# EAGLE design MF_NG (EAGLE 7.1.0)

## Sheet 1 of 2
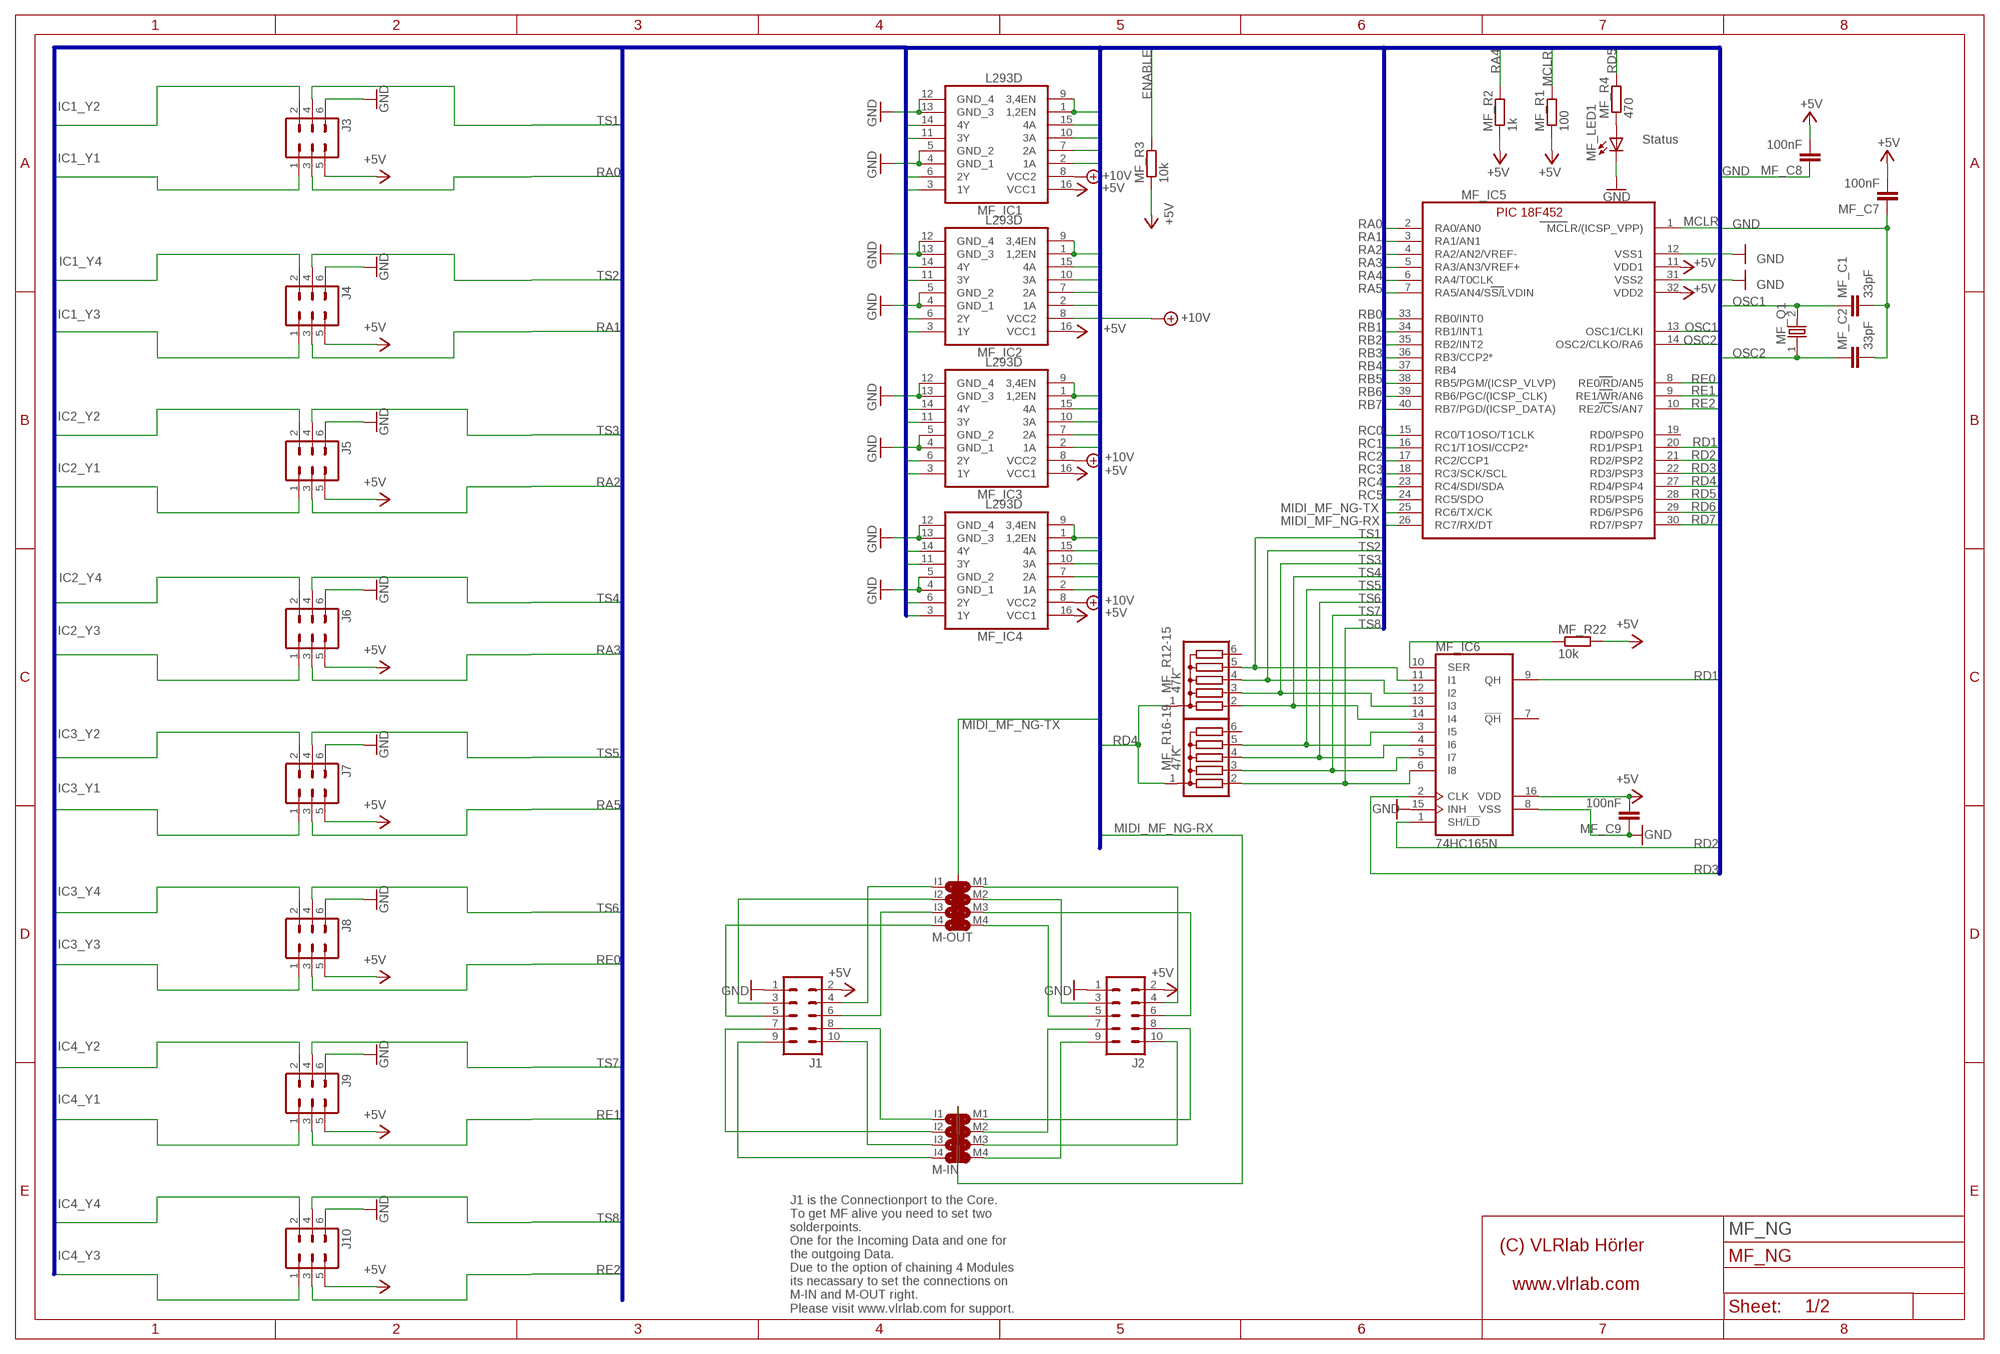
[diagram p0: schematic, sheet 1]

### Parts
J1  ML10ML10_TEXTFRONT  [ML10_TEXTFRONT]
J2  ML10ML10_TEXTFRONT  [ML10_TEXTFRONT]
J3  ML6  [ML6]
J4  ML6  [ML6]
J5  ML6  [ML6]
J6  ML6  [ML6]
J7  ML6  [ML6]
J8  ML6  [ML6]
J9  ML6  [ML6]
J10  ML6  [ML6]
M-IN  SJ2X4MIDI  [SJ_2X4MIDI]
M-OUT  SJ2X4MIDI  [SJ_2X4MIDI]
MF_C1  33pF  C-EU025-030X050  [C025-030X050]
MF_C2  33pF  C-EU025-030X050  [C025-030X050]
MF_C7  100nF  C-EU025-025X050  [C025-025X050]
MF_C8  100nF  C-EU025-025X050  [C025-025X050]
MF_C9  100nF  C-EU025-025X050  [C025-025X050]
MF_IC1  L293D  [DIL16]
MF_IC2  L293D  [DIL16]
MF_IC3  L293D  [DIL16]
MF_IC4  L293D  [DIL16]
MF_IC5  PIC18F452  PIC18F4X2DIL40  [DIL40]
MF_IC6  74HC165N  [DIL16]
MF_LED1  Status  LED3MM  [LED3MM]
MF_Q1  ECS-100-20-4X-DU  [HC-49/USX]
MF_R1  100  R-EU_0204/7  [0204/7]
MF_R2  1k  R-EU_0204/7  [0204/7]
MF_R3  10k  R-EU_0204/7  [0204/7]
MF_R4  470  R-EU_0204/7  [0204/7]
MF_R12-15  47k  4306R  [SIL6]
MF_R16-19  47K  4306R  [SIL6]
MF_R22  10k  R-EU_0204/7  [0204/7]

### Nets
+5V [VDD]: J1.2 J2.2 J3.5 J4.5 J5.5 J6.5 J7.5 J8.5 J9.5 J10.5 MF_C7.2 MF_C8.2 MF_C9.2 MF_IC1.16(VCC1) MF_IC2.16(VCC1) MF_IC3.16(VCC1) MF_IC4.16(VCC1) MF_IC5.11(VDD1) MF_IC5.32(VDD2) MF_IC6.16(VDD) MF_R1.1 MF_R2.1 MF_R3.1 MF_R22.2 ; also sheet 2
+10V [10V]: MF_IC1.8(VCC2) MF_IC2.8(VCC2) MF_IC3.8(VCC2) MF_IC4.8(VCC2) ; also sheet 2
ENABLE: MF_IC1.1(1,2EN) MF_IC1.9(3,4EN) MF_IC2.1(1,2EN) MF_IC2.9(3,4EN) MF_IC3.1(1,2EN) MF_IC3.9(3,4EN) MF_IC4.1(1,2EN) MF_IC4.9(3,4EN) MF_R3.2
GND: J1.1 J2.1 J3.6 J4.6 J5.6 J6.6 J7.6 J8.6 J9.6 J10.6 MF_C1.2 MF_C2.2 MF_C7.1 MF_C8.1 MF_C9.1 MF_IC1.4(GND_1) MF_IC1.5(GND_2) MF_IC1.12(GND_4) MF_IC1.13(GND_3) MF_IC2.4(GND_1) MF_IC2.5(GND_2) MF_IC2.12(GND_4) MF_IC2.13(GND_3) MF_IC3.4(GND_1) MF_IC3.5(GND_2) MF_IC3.12(GND_4) MF_IC3.13(GND_3) MF_IC4.4(GND_1) MF_IC4.5(GND_2) MF_IC4.12(GND_4) MF_IC4.13(GND_3) MF_IC5.12(VSS1) MF_IC5.31(VSS2) MF_IC6.8(VSS) MF_IC6.15(INH) MF_LED1.K(C) ; also sheet 2
IC1_Y1 [10V]: J3.1 MF_IC1.3(1Y)
IC1_Y2 [10V]: J3.2 MF_IC1.6(2Y)
IC1_Y3 [10V]: J4.1 MF_IC1.11(3Y)
IC1_Y4 [10V]: J4.2 MF_IC1.14(4Y)
IC2_Y1 [10V]: J5.1 MF_IC2.3(1Y)
IC2_Y2 [10V]: J5.2 MF_IC2.6(2Y)
IC2_Y3 [10V]: J6.1 MF_IC2.11(3Y)
IC2_Y4 [10V]: J6.2 MF_IC2.14(4Y)
IC3_Y1 [10V]: J7.1 MF_IC3.3(1Y)
IC3_Y2 [10V]: J7.2 MF_IC3.6(2Y)
IC3_Y3 [10V]: J8.1 MF_IC3.11(3Y)
IC3_Y4 [10V]: J8.2 MF_IC3.14(4Y)
IC4_Y1 [10V]: J9.1 MF_IC4.3(1Y)
IC4_Y2 [10V]: J9.2 MF_IC4.6(2Y)
IC4_Y3 [10V]: J10.1 MF_IC4.11(3Y)
IC4_Y4 [10V]: J10.2 MF_IC4.14(4Y)
MCLR: MF_IC5.1(MCLR/(ICSP_VPP)) MF_R1.2
MIDI_MF_NG-RX: M-IN.0 MF_IC5.26(RC7/RX/DT)
MIDI_MF_NG-TX: M-OUT.0 MF_IC5.25(RC6/TX/CK)
N$1: MF_IC6.10(SER) MF_R22.1
N$2: MF_LED1.A MF_R4.1
N$3: J1.4 M-OUT.I1
N$4: J1.3 M-OUT.I2
N$5: J1.6 M-OUT.I3
N$6: J1.5 M-OUT.I4
N$7: J2.4 M-OUT.M1
N$8: J2.3 M-OUT.M2
N$9: J2.6 M-OUT.M3
N$10: J2.5 M-OUT.M4
N$11: J1.8 M-IN.I1
N$12: J1.7 M-IN.I2
N$13: J1.10 M-IN.I3
N$14: J1.9 M-IN.I4
N$15: J2.8 M-IN.M1
N$16: J2.7 M-IN.M2
N$17: J2.10 M-IN.M3
N$18: J2.9 M-IN.M4
OSC1: MF_C1.1 MF_IC5.13(OSC1/CLKI) MF_Q1.2
OSC2: MF_C2.1 MF_IC5.14(OSC2/CLKO/RA6) MF_Q1.1
RA0: J3.3 MF_IC5.2(RA0/AN0)
RA1: J4.3 MF_IC5.3(RA1/AN1)
RA2: J5.3 MF_IC5.4(RA2/AN2/VREF-)
RA3: J6.3 MF_IC5.5(RA3/AN3/VREF+)
RA4: MF_IC5.6(RA4/T0CLK) MF_R2.2
RA5: J7.3 MF_IC5.7(RA5/AN4/SS/LVDIN)
RB0: MF_IC2.15(4A) MF_IC5.33(RB0/INT0)
RB1: MF_IC2.10(3A) MF_IC5.34(RB1/INT1)
RB2: MF_IC2.7(2A) MF_IC5.35(RB2/INT2)
RB3: MF_IC2.2(1A) MF_IC5.36(RB3/CCP2*)
RB4: MF_IC1.15(4A) MF_IC5.37(RB4)
RB5: MF_IC1.10(3A) MF_IC5.38(RB5/PGM/(ICSP_VLVP))
RB6: MF_IC1.7(2A) MF_IC5.39(RB6/PGC/(ICSP_CLK))
RB7: MF_IC1.2(1A) MF_IC5.40(RB7/PGD/(ICSP_DATA))
RC0: MF_IC4.15(4A) MF_IC5.15(RC0/T1OSO/T1CLK)
RC1: MF_IC4.10(3A) MF_IC5.16(RC1/T1OSI/CCP2*)
RC2: MF_IC4.7(2A) MF_IC5.17(RC2/CCP1)
RC3: MF_IC4.2(1A) MF_IC5.18(RC3/SCK/SCL)
RC4: MF_IC3.15(4A) MF_IC5.23(RC4/SDI/SDA)
RC5: MF_IC3.10(3A) MF_IC5.24(RC5/SDO)
RD1: MF_IC5.20(RD1/PSP1) MF_IC6.9(QH)
RD2: MF_IC5.21(RD2/PSP2) MF_IC6.1(SH/!LD)
RD3: MF_IC5.22(RD3/PSP3) MF_IC6.2(CLK)
RD4: MF_IC5.27(RD4/PSP4) MF_R12-15.1 MF_R16-19.1
RD5: MF_IC5.28(RD5/PSP5) MF_R4.2
RD6: MF_IC3.7(2A) MF_IC5.29(RD6/PSP6)
RD7: MF_IC3.2(1A) MF_IC5.30(RD7/PSP7)
RE0: J8.3 MF_IC5.8(RE0/RD/AN5)
RE1: J9.3 MF_IC5.9(RE1/WR/AN6)
RE2: J10.3 MF_IC5.10(RE2/CS/AN7)
TS1: J3.4 MF_IC6.11(I1) MF_R12-15.5
TS2: J4.4 MF_IC6.12(I2) MF_R12-15.4
TS3: J5.4 MF_IC6.13(I3) MF_R12-15.3
TS4: J6.4 MF_IC6.14(I4) MF_R12-15.2
TS5: J7.4 MF_IC6.3(I5) MF_R16-19.5
TS6: J8.4 MF_IC6.4(I6) MF_R16-19.4
TS7: J9.4 MF_IC6.5(I7) MF_R16-19.3
TS8: J10.4 MF_IC6.6(I8) MF_R16-19.2
Unconnected: MF_IC5.19(RD0/PSP0) MF_IC6.7(!QH) MF_R12-15.6 MF_R16-19.6

### Buses
ENABLE,IC1_Y[1..4],IC2_Y[1..4],IC3_Y[1..4],IC4_Y[1..4],MCLR,RA0,RA1,RA2,RA3,RA4,RA5,RE0,RE1,RE2,VDD_5V,VDD_M,GND,OSC1,OSC2,RC0,RC1,RC2,RC3,RD0,RD1,RD2,RD3,RC4,RC5,TX,RX,RD4,RD5,RD6,RD7,RB0,RB1,RB2,RB3,RB4,RB5,RB6,RB7,TS1,TS2,TS3,TS4,TS5,TS6,TS7,TS8,MIDI_MF_NG-TX,MIDI_MF_NG-RX

### Notes on the sheet
- MF_NG
- J1 is the Connectionport to the Core.
  To get MF alive you need to set two
  solderpoints.
  One for the Incoming Data and one for 
  the outgoing Data.
  Due to the option of chaining 4 Modules 
  its necassary to set the connections on 
  M-IN and M-OUT right.
  Please visit www.vlrlab.com for support.

## Sheet 2 of 2
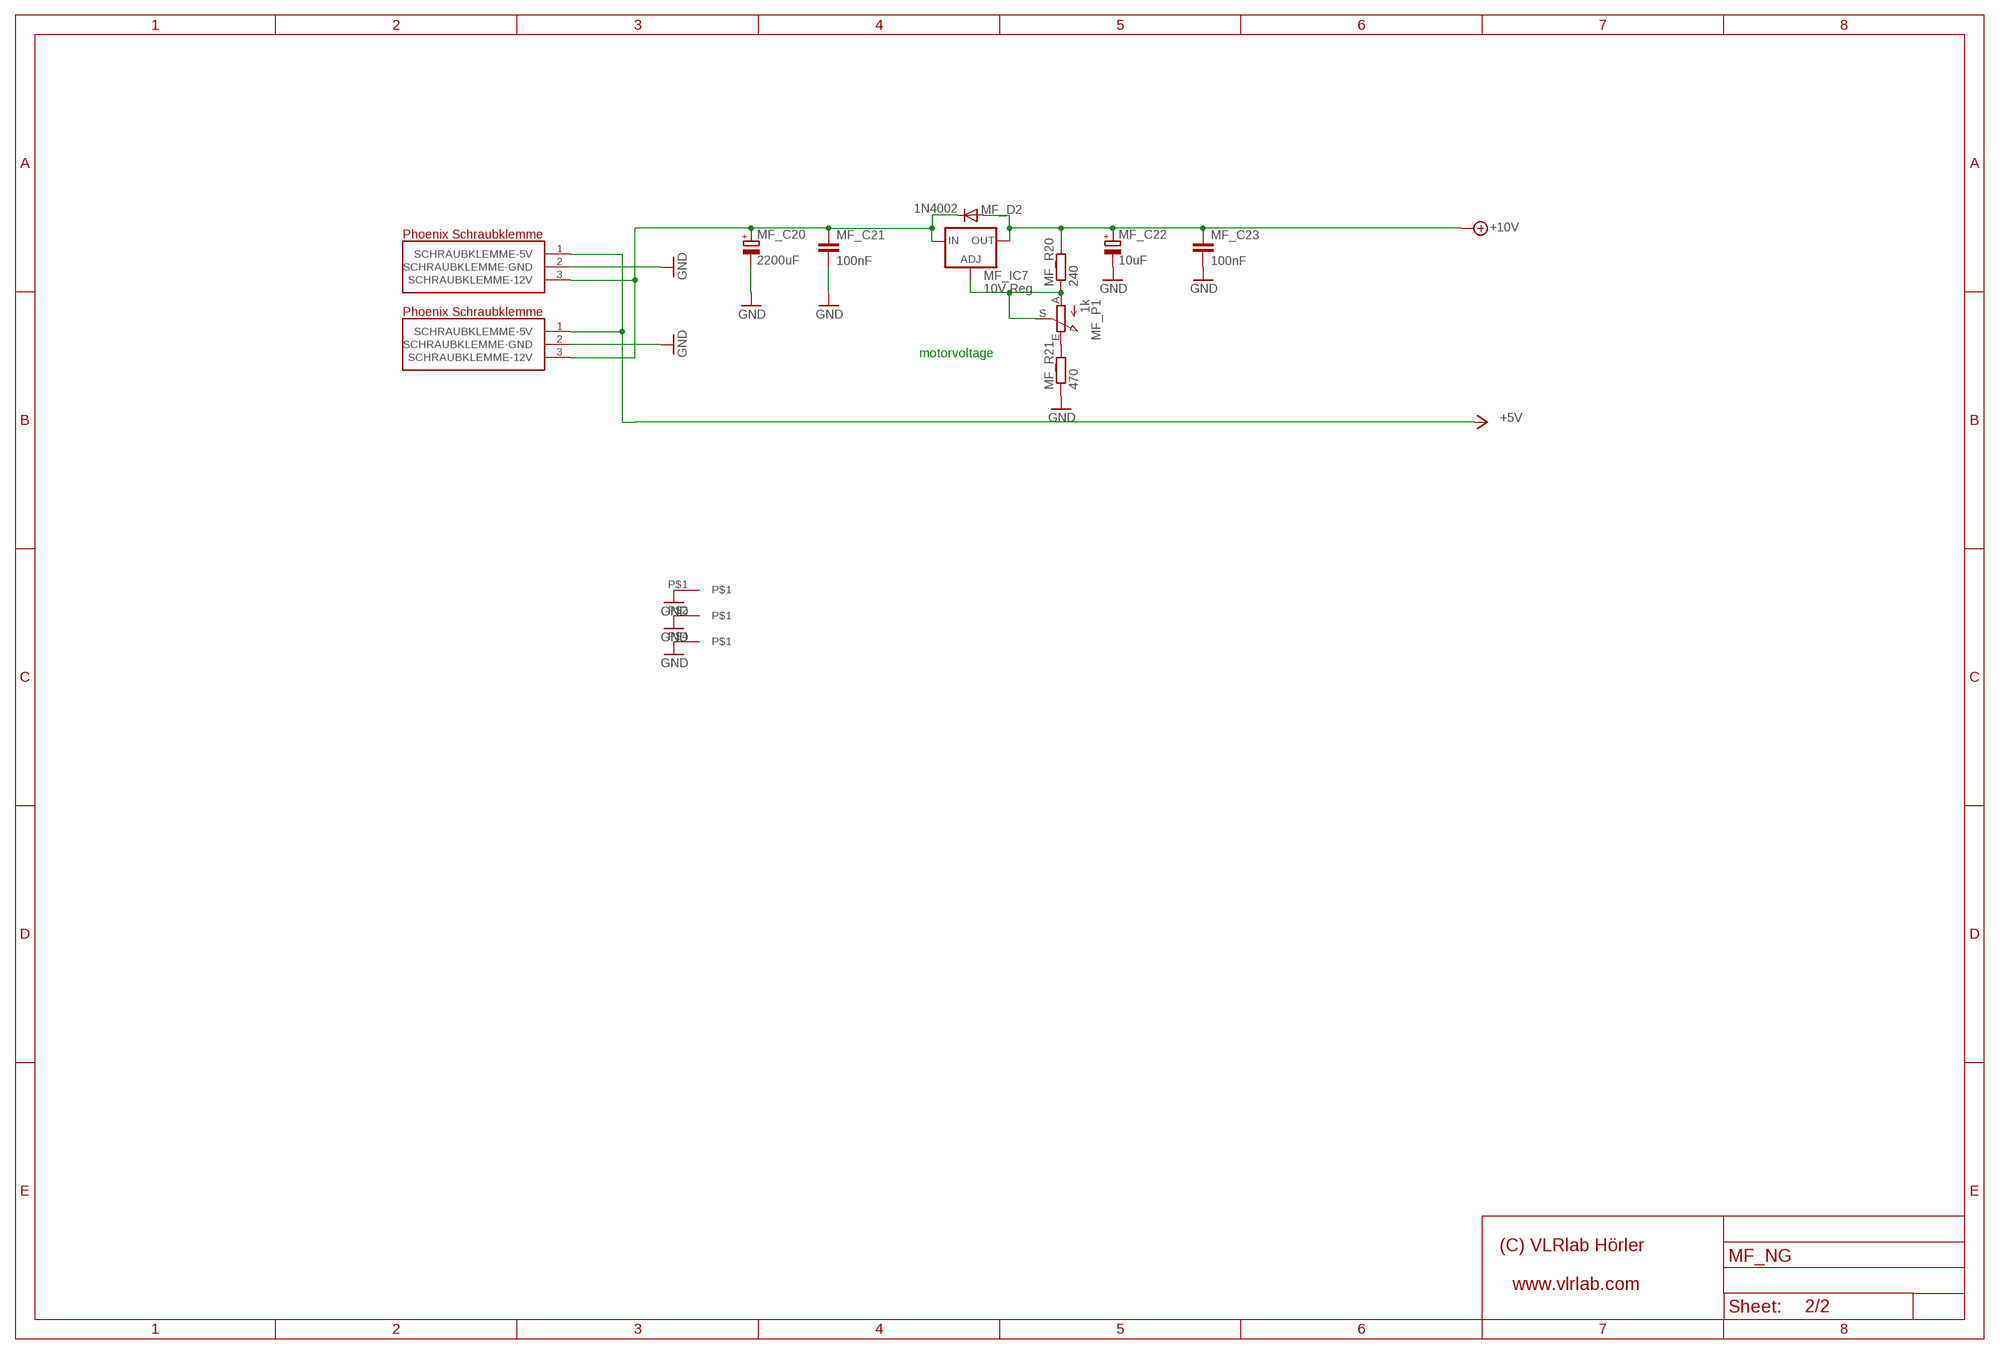
[diagram p1: schematic, sheet 2]

### Parts
KLEMME1  PT-1.5/3  [PT-1.5/3-5.0]
KLEMME2  PT-1.5/3  [PT-1.5/3-5.0]
MF_C20  2200uF  CPOL-EUE5-13  [E5-13]
MF_C21  100nF  C-EU025-025X050  [C025-025X050]
MF_C22  10uF  CPOL-EUE2,5-6E  [E2,5-6E]
MF_C23  100nF  C-EU025-025X050  [C025-025X050]
MF_D2  1N4002  [D040-10]
MF_IC7  10V Reg  LM317TS  [317TS]
MF_P1  1k  PHIER_6MM  [6MM_V]
MF_R20  240  R-EU_0204/7  [0204/7]
MF_R21  470  R-EU_0204/7  [0204/7]
U$3  MIDIBOX_HALF  [MIDIBOX14X6]

### Nets
+5V [VDD]: KLEMME1.1(SCHRAUBKLEMME-5V) KLEMME2.1(SCHRAUBKLEMME-5V) ; also sheet 1
+10V [10V]: MF_C22.+ MF_C23.1 MF_D2.A MF_IC7.2(OUT) MF_R20.2 ; also sheet 1
+12V [10V]: KLEMME1.3(SCHRAUBKLEMME-12V) KLEMME2.3(SCHRAUBKLEMME-12V) MF_C20.+ MF_C21.1 MF_D2.C MF_IC7.3(IN)
GND: KLEMME1.2(SCHRAUBKLEMME-GND) KLEMME2.2(SCHRAUBKLEMME-GND) MF_C20.- MF_C21.2 MF_C22.- MF_C23.2 MF_R21.1 U$3.P$1 U$3.P$2 U$3.P$4 ; also sheet 1
N$98: MF_IC7.1(ADJ) MF_P1.A MF_P1.S MF_R20.1
N$105: MF_P1.E MF_R21.2

### Notes on the sheet
- motorvoltage

## Library data of the parts
J1 J2 = con-ml_Ivan:ML10: HARTING
J3-J10 = con-ml:ML6: HARTING; OC_FARNELL: unknown; OC_NEWARK: unknown
KLEMME1 KLEMME2 = Phonenix Contacts:PT-1.5/3
M-IN M-OUT = Jumper:SJ2X4MIDI
MF_C1 MF_C2 MF_C7-MF_C9 MF_C21 MF_C23 = rcl:C-EU: CAPACITOR, European symbol
MF_C20 = resistor:CPOL-EU: POLARIZED CAPACITOR, European symbol
MF_C22 = rcl:CPOL-EU: POLARIZED CAPACITOR, European symbol
MF_D2 = Diode 1N4002:1N4002
MF_IC1-MF_IC4 = L293:L293D
MF_IC5 = pic18f452:PIC18F4X2: Pic Microcontroller
MF_IC6 = 74-595:74HC165N
MF_IC7 = v-reg:LM317TS: VOLTAGE REGULATOR
MF_LED1 = led:LED: LED OSRAM: - CHIPLED LG R971, LG N971, LY N971, LG Q971, LY Q971, LO R971, LY R971 LH N974, LH R974 LS Q976, LO Q976, LY Q976 LO Q996 - Hyper CHIPLED LW Q18S LB Q993, LB Q99A, LB R99A - SideLED LS A670, LO A670, LY A670, LG A670, LP A670 LB A673, LV A673, LT A673, LW A673 LH A674 LY A675 LS A676, LA A676, LO A676, LY A676, LW A676 LS A679, LY A679, LG A679 - Hyper Micro SIDELED® LS Y876, LA Y876, LO Y876, LY Y876 LT Y87S - SmartLED LW L88C, LW L88S LB L89C, LB L89S, LG L890 LS L89K, LO L89K, LY L89K LS L896, LA L896, LO L896, LY L896 - TOPLED LS T670, LO T670, LY T670, LG T670, LP T670 LSG T670, LSP T670, LSY T670, LOP T670, LYG T670 LG T671, LOG T671, LSG T671 LB T673, LV T673, LT T673, LW T673 LH T674 LS T676, LA T676, LO T676, LY T676, LB T676, LH T676, LSB T676, LW T676 LB T67C, LV T67C, LT T67C, LS T67K, LO T67K, LY T67K, LW E67C LS E67B, LA E67B, LO E67B, LY E67B, LB E67C, LV E67C, LT E67C LW T67C LS T679, LY T679, LG T679 LS T770, LO T770, LY T770, LG T770, LP T770 LB T773, LV T773, LT T773, LW T773 LH T774 LS E675, LA E675, LY E675, LS T675 LS T776, LA T776, LO T776, LY T776, LB T776 LHGB T686 LT T68C, LB T68C - Hyper Mini TOPLED® LB M676 - Mini TOPLED Santana® LG M470 LS M47K, LO M47K, LY M47K Source: http://www.osram.convergy.de LUXEON: - LUMILED® LXK2-PW12-R00, LXK2-PW12-S00, LXK2-PW14-U00, LXK2-PW14-V00 LXK2-PM12-R00, LXK2-PM12-S00, LXK2-PM14-U00 LXK2-PE12-Q00, LXK2-PE12-R00, LXK2-PE12-S00, LXK2-PE14-T00, LXK2-PE14-U00 LXK2-PB12-K00, LXK2-PB12-L00, LXK2-PB12-M00, LXK2-PB14-N00, LXK2-PB14-P00, LXK2-PB14-Q00 LXK2-PR12-L00, LXK2-PR12-M00, LXK2-PR14-Q00, LXK2-PR14-R00 LXK2-PD12-Q00, LXK2-PD12-R00, LXK2-PD12-S00 LXK2-PH12-R00, LXK2-PH12-S00 LXK2-PL12-P00, LXK2-PL12-Q00, LXK2-PL12-R00 Source: www.luxeon.com KINGBRIGHT: KA-3528ASYC Source: www.kingbright.com
MF_P1 = Potentiometer 6mm:PHIER_6MM
MF_Q1 = Cristal_10MHz:ECS-100-20-4X-DU
MF_R1-MF_R4 MF_R22 = resistor:R-EU_: RESISTOR, European symbol
MF_R12-15 MF_R16-19 = Bourns Resistor Array:4306R
MF_R20 MF_R21 = rcl:R-EU_: RESISTOR, European symbol
U$3 = Frames_VLR:MIDIBOX_HALF

## Net classes
0 default: width 0.254 mm, drill 0.33 mm, clearance 0.203 mm
1 VDD: width 0.813 mm, drill 0.33 mm, clearance 0.203 mm to class 0, clearance 0.203 mm
2 10V: width 1.016 mm, drill 0.33 mm, clearance 0.254 mm to class 0, clearance 0.203 mm to class 1, clearance 0.203 mm

## Board
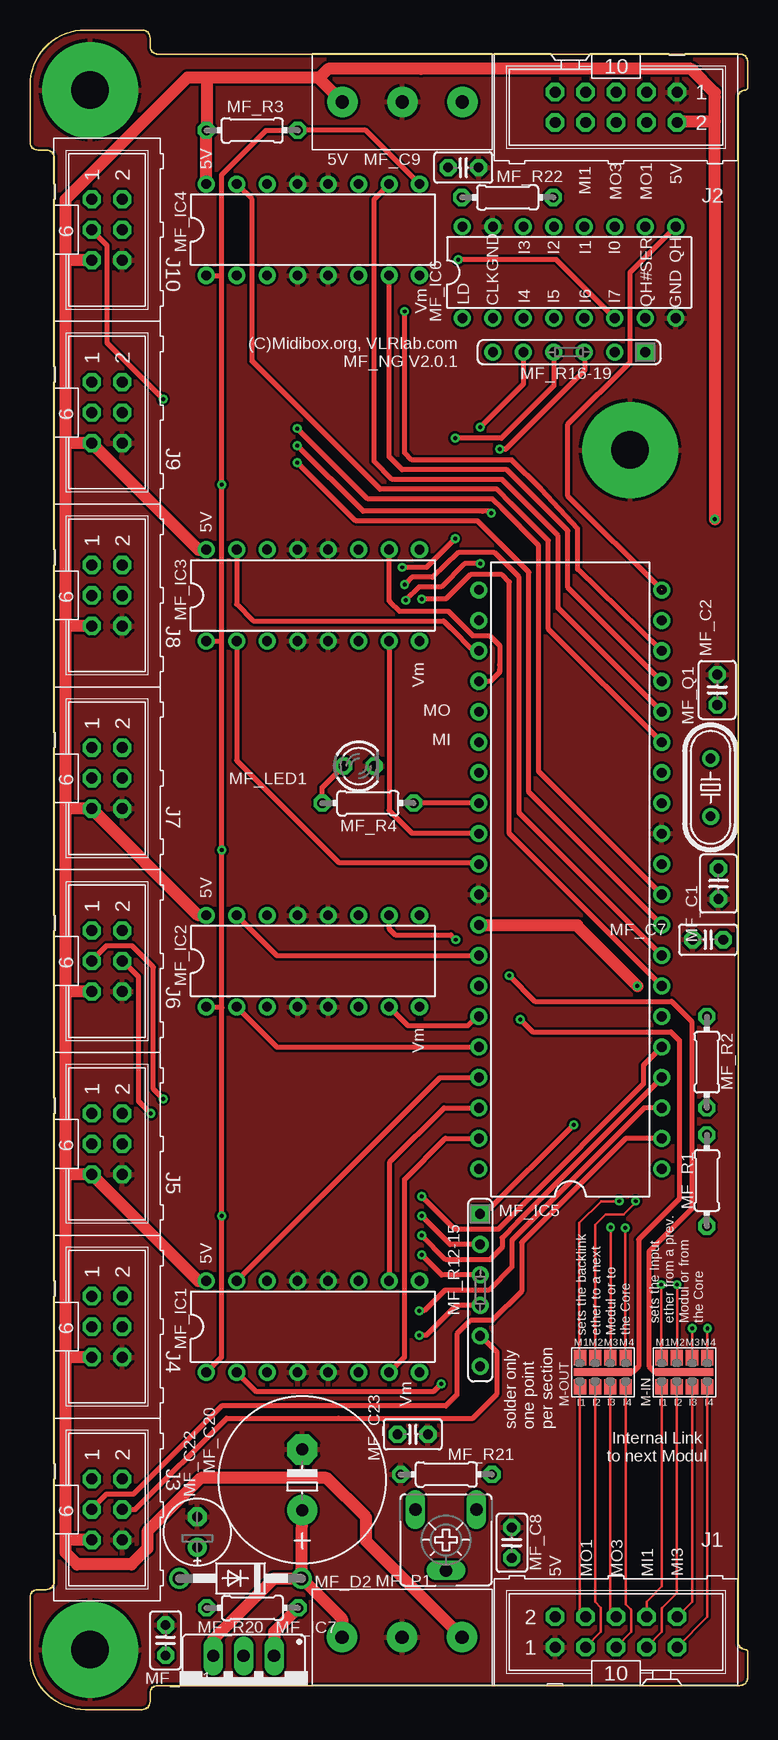
[diagram p2: board, top side]
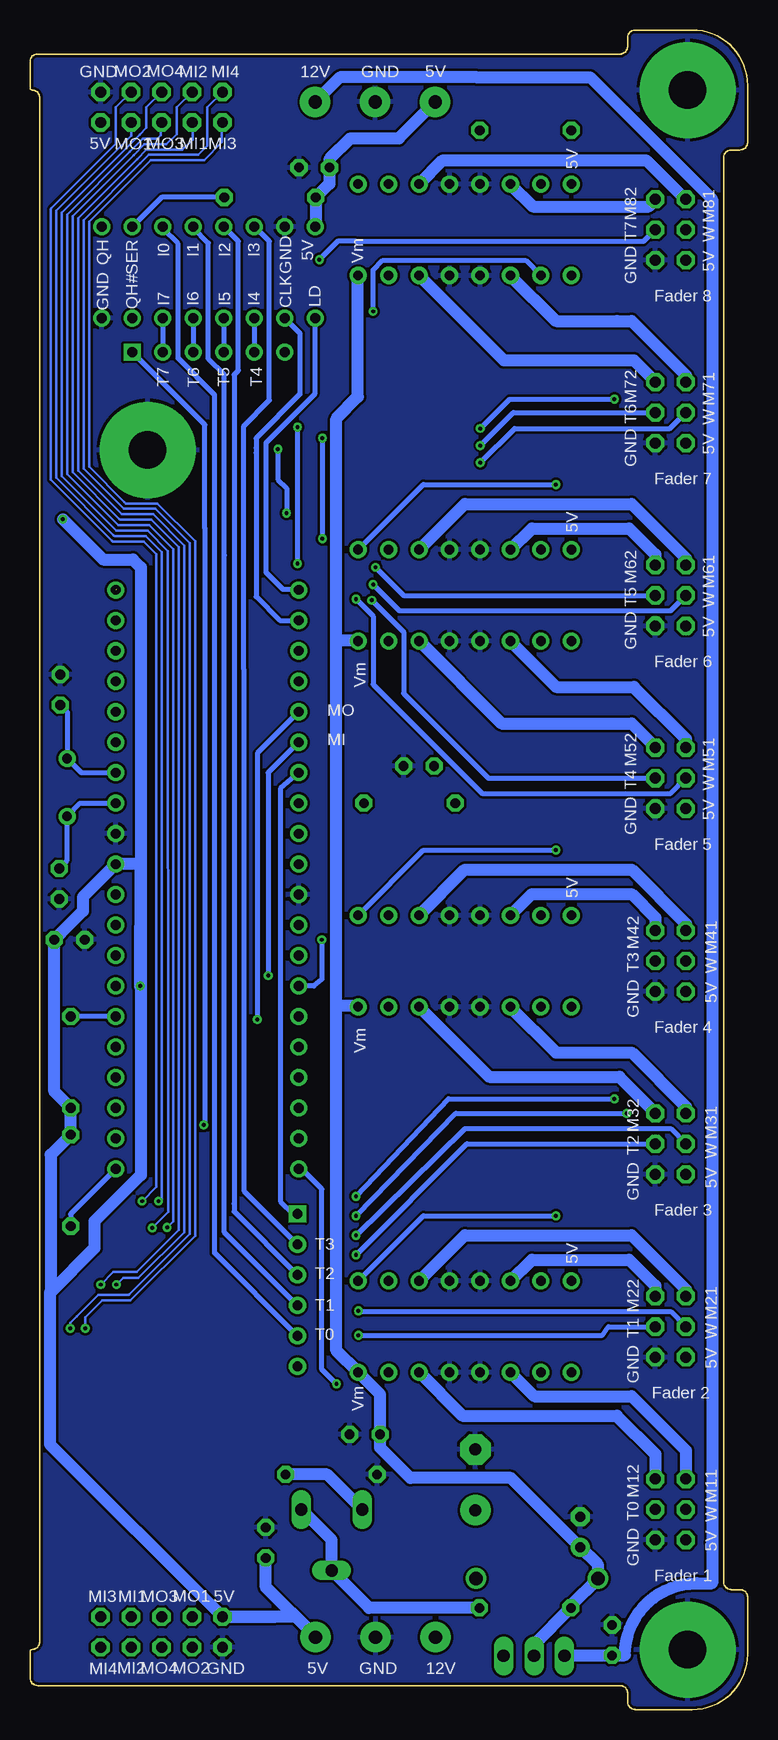
[diagram p3: board, bottom side, seen from below]

Size 59.8 x 140 mm. Coordinates in mm from the lower left corner, seen from the top.
Copper layers (1*16): Top 0.035mm / dielectric 1.5mm / Bottom 0.035mm
Design rules "makePCB *": minimum track width 8mil, minimum drill 13mil, track to track 8mil, track to pad 8mil, pad to pad 8mil, via to via 8mil, smd to smd 8mil, copper to edge 8mil, drill to drill 8mil, minimum pad ring 12mil, minimum via ring 8mil, stop-mask expansion 4mil, vias tented up to drill 0mil, thermal gap 10mil

### Footprints (pad centres in the part's own frame; a part is rotated, then mirrored left to right if it is on the bottom)
ML10_TEXTFRONT = drill 0.914 octagon: 1 -5.08,-1.27; 2 -5.08,1.27; 3 -2.54,-1.27; 4 -2.54,1.27; 5 0,-1.27; 6 0,1.27; 7 2.54,-1.27; 8 2.54,1.27; 9 5.08,-1.27; 10 5.08,1.27
ML6 = drill 0.914 octagon: 1 -2.54,-1.27; 2 -2.54,1.27; 3 0,-1.27; 4 0,1.27; 5 2.54,-1.27; 6 2.54,1.27
PT-1.5/3-5.0 = drill 1.1 pad 2.54: 1 5,0; 2 0,0; 3 -5,0
SJ_2X4MIDI = smd 4.826 x 0.635: 0 0.01,0.01 | smd 1.016 x 1.27: I1 -1.895,-1.209; I2 -0.625,-1.209; I3 0.645,-1.209; I4 1.915,-1.209; M1 -1.895,1.229; M2 -0.625,1.229; M3 0.645,1.229; M4 1.915,1.229
C025-030X050 = drill 0.813 octagon: 1 -1.27,0; 2 1.27,0
C025-025X050 = drill 0.813 octagon: 1 -1.27,0; 2 1.27,0
E5-13 = drill 1.016 pad 2.54: + -2.54,0 | drill 1.016 pad 2.54 octagon: - 2.54,0
E2,5-6E = drill 0.813 pad 1.575: + -1.27,0 | drill 0.813 pad 1.575 octagon: - 1.27,0
D040-10 = drill 1.118: A 5.08,0; C -5.08,0
DIL16 = drill 0.813: 1 -7.62,-3.81; 2 -5.08,-3.81; 3 -2.54,-3.81; 4 0,-3.81; 5 2.54,-3.81; 6 5.08,-3.81; 7 7.62,-3.81; 8 10.16,-3.81; 9 10.16,3.81; 10 7.62,3.81; 11 5.08,3.81; 12 2.54,3.81; 13 0,3.81; 14 -2.54,3.81; 15 -5.08,3.81; 16 -7.62,3.81
DIL40 = drill 0.813: 1 -24.13,-7.62; 2 -21.59,-7.62; 3 -19.05,-7.62; 4 -16.51,-7.62; 5 -13.97,-7.62; 6 -11.43,-7.62; 7 -8.89,-7.62; 8 -6.35,-7.62; 9 -3.81,-7.62; 10 -1.27,-7.62; 11 1.27,-7.62; 12 3.81,-7.62; 13 6.35,-7.62; 14 8.89,-7.62; 15 11.43,-7.62; 16 13.97,-7.62; 17 16.51,-7.62; 18 19.05,-7.62; 19 21.59,-7.62; 20 24.13,-7.62; 21 24.13,7.62; 22 21.59,7.62; 23 19.05,7.62; 24 16.51,7.62; 25 13.97,7.62; 26 11.43,7.62; 27 8.89,7.62; 28 6.35,7.62; 29 3.81,7.62; 30 1.27,7.62; 31 -1.27,7.62; 32 -3.81,7.62; 33 -6.35,7.62; 34 -8.89,7.62; 35 -11.43,7.62; 36 -13.97,7.62; 37 -16.51,7.62; 38 -19.05,7.62; 39 -21.59,7.62; 40 -24.13,7.62
DIL16' = drill 0.813: 1 -8.89,-3.81; 2 -6.35,-3.81; 3 -3.81,-3.81; 4 -1.27,-3.81; 5 1.27,-3.81; 6 3.81,-3.81; 7 6.35,-3.81; 8 8.89,-3.81; 9 8.89,3.81; 10 6.35,3.81; 11 3.81,3.81; 12 1.27,3.81; 13 -1.27,3.81; 14 -3.81,3.81; 15 -6.35,3.81; 16 -8.89,3.81
317TS = drill 1.016 long: 1 -2.54,-2.54; 2 0,-2.54; 3 2.54,-2.54
LED3MM = drill 0.813 octagon: A -1.27,0; K 1.27,0
6MM_V = drill 1.016 long: A -2.54,-2.54; E 2.54,-2.54; S 0,2.54
HC-49/USX = drill 0.813: 1 -2.413,0; 2 2.413,0
0204/7 = drill 0.813 octagon: 1 -3.81,0; 2 3.81,0
SIL6 = drill 0.813 square: 1 -6.35,0 | drill 0.813: 2 -3.81,0; 3 -1.27,0; 4 1.27,0; 5 3.81,0; 6 6.35,0
MIDIBOX14X6 = drill 3.1 pad 8: P$1 5,135; P$2 50,105; P$4 5,5

### Placement (x,y rotation side)
J1  48.84,6.46 0 top
J2  48.84,133.56 180 top
J3  6.42,16.67 270 top
J4  6.42,31.91 270 top
J5  6.42,47.15 270 top
J6  6.42,62.39 270 top
J7  6.42,77.63 270 top
J8  6.42,92.87 270 top
J9  6.42,108.11 270 top
J10  6.42,123.35 270 top
KLEMME1  31.01,6.03 0 top
KLEMME2  31.03,134 180 top
M-IN  54.53,28.1 0 top
M-OUT  47.72,28.1 0 top
MF_C1  57.37,68.84 270 top
MF_C2  57.27,85 90 top
MF_C7  56.51,64.17 0 top
MF_C8  40.15,13.9 270 top
MF_C9  36.11,128.53 180 top
MF_C20  22.69,19.15 90 top
MF_C21  11.3,5.77 90 top
MF_C22  13.94,14.79 90 top
MF_C23  31.9,22.94 0 top
MF_D2  17.55,10.93 180 top
MF_IC1  22.3,31.91 0 top
MF_IC2  22.3,62.39 0 top
MF_IC3  22.3,92.87 0 top
MF_IC4  22.3,123.35 0 top
MF_IC5  45.03,69.2 90 top
MF_IC6  74HC165N  [DIL16']  44.93,119.79 0 top
MF_IC7  17.8,1.94 180 top
MF_LED1  27.4,78.65 0 top
MF_P1  34.66,14.13 180 top
MF_Q1  56.71,76.87 270 top
MF_R1  56.41,44.1 270 top
MF_R2  56.41,53.96 90 top
MF_R3  18.51,131.63 0 top
MF_R4  28.16,75.55 0 top
MF_R12-15  37.51,34.96 270 top
MF_R16-19  44.93,113.14 180 top
MF_R20  18.54,8.47 180 top
MF_R21  34.69,19.59 0 top
MF_R22  39.8,126.04 180 top
U$3  0,0 0 top
U$5  [VLRLAB_SMAL]  30.55,61.12 0 bottom
U$6  [VLRLAB]  20.39,42.07 90 top

### Tracks (layer width: path | path; a pad name or v marks a point on that pad's centre or on a via)
+5V  (via drill 0.33)
  Top 1.016: 2.97,14.13 2.97,13.93 2.97,13.06 3.93,12.1 8.45,12.1 9.77,13.42 9.77,14.84 14.24,19.31 24.71,19.31 28.01,16.01 28.01,14.02 KLEMME1.1 | 2.97,14.13 2.97,29.37 | 2.97,29.37 2.97,44.61 | 2.97,44.61 2.97,59.85 | 2.97,59.85 2.97,75.09 | 2.97,75.09 2.97,90.33 | 2.97,90.33 2.97,105.57 | 2.97,105.57 2.97,120.81 | 2.97,120.81 2.97,125.89 13.13,136.05 14.75,136.05 | 14.75,136.05 21.15,136.05 23.99,136.05 | J10.5 2.97,120.81 | 2.97,105.57 J9.5 14.04,96.68 MF_IC3.16 | MF_IC4.16 14.7,127.18 MF_R3.1 14.75,131.68 14.75,136.05 | 2.97,75.09 J7.5 14.04,66.2 MF_IC2.16 14.75,66.2 | J6.5 2.97,59.85 | 2.97,44.61 J5.5 14.04,35.72 MF_IC1.16 | J4.5 2.97,29.37 | J3.5 2.97,14.13 | J8.5 2.97,90.33 | 23.99,136.05 KLEMME2.1 | v57.07,99.22 57.07,125.79 57.07,132.39 | 57.07,132.39 57.07,134.42 57.07,134.78 55.09,136.76 32.58,136.76 24.86,136.76 24.15,136.05 23.99,136.05 | J2.2 54.02,132.39 57.07,132.39 | MF_IC5.32 45.64,65.39 45.64,65.29 v50.62,60.31
  Bottom 1.016: KLEMME2.1 29.07,130.97 33.09,130.97 34.84,129.22 MF_C9.2 34.84,127.18 MF_R22.2 35.99,123.65 MF_IC6.16 | 39.34,7.73 37.66,7.73 36.04,6.1 36.03,6.1 40.15,10.17 MF_C8.2 | 39.34,7.73 J1.2 | v57.07,99.22 53.72,95.87 51.23,95.87 50.57,95.21 50.57,70.47 | 50.57,70.47 50.57,44.56 54.43,40.7 54.43,38.46 58.08,34.81 | 58.08,34.81 58.13,34.75 58.13,22.11 J1.2 | 43.81,7.73 J1.2 | J1.2 39.34,7.73 | 58.08,34.81 58.08,46.24 MF_R1.1 MF_R2.1 57.78,51.52 MF_C7.2 57.27,64.68 55.39,66.56 55.39,67.72 MF_IC5.11 50.57,70.47 | v50.62,60.31 50.57,70.47
+10V
  Bottom 1.016: 34.26,58.63 34.26,29.9 MF_IC1.8 30.63,26.27 MF_C23.1 30.63,21.83 28.11,19.31 19.73,19.31 MF_C22.+ 12.47,12.05 MF_D2.A 14.73,8.67 MF_R20.2 17.8,5.39 MF_IC7.2 | 34.26,58.63 34.26,89.11 | 34.26,89.11 34.26,107.6 32.48,109.43 32.48,119.54 MF_IC4.8 | MF_IC3.8 32.51,89.11 34.26,89.11 | MF_IC2.8 32.51,58.63 34.26,58.63
+12V
  Top 1.016: MF_IC7.3 15.26,5.85 20.34,10.93 MF_D2.C | MF_D2.C 22.63,13.82 MF_C20.+ | MF_D2.C 26.01,7.55 KLEMME1.3
  Bottom 1.016: KLEMME2.3 33.99,136.05 22.53,136.05 13.13,136.05 2.97,125.89 2.97,13.93 2.97,10.52 4.24,10.52 arc-90 10.23,4.53 10.94,4.53 arc-90 11.02,4.45 MF_C21.1 11.07,4.48 MF_IC7.3
ENABLE  (via drill 0.33)
  Top 0.406: MF_IC1.1 15.97,29.39 v15.97,41.16 15.97,58.43 | 15.97,58.43 v15.97,71.64 15.97,89.11 | 15.97,89.11 v15.97,102.12 15.97,120 | 15.97,120 15.97,127.92 19.68,131.63 MF_R3.2 27.99,131.63 MF_IC4.9 | MF_IC4.1 15.97,119.54 15.97,120 | MF_IC3.1 15.97,89.06 15.97,89.11 | MF_IC2.1 15.97,58.58 15.97,58.43
  Bottom 0.406: MF_IC1.9 27.02,41.16 v15.97,41.16 | MF_IC2.9 27.02,71.64 v15.97,71.64 | MF_IC3.9 27.02,102.12 v15.97,102.12
GND
  pour Bottom: -0.16,-0.35 -0.06,140.07 59.8,140.27 59.8,-0.55
  pour Top: -0.16,-0.35 -0.06,140.07 59.8,140.27 59.8,-0.55
IC1_Y1
  Bottom 1.016: MF_IC1.3 17.78,26.12 9.67,26.12 5.15,21.6 J3.1
IC1_Y2
  Bottom 1.016: MF_IC1.6 23.77,24.49 10.89,24.49 7.69,21.29 J3.2
IC1_Y3
  Bottom 1.016: MF_IC1.11 23.57,39.53 9.67,39.53 5.15,35.01 J4.1
IC1_Y4
  Bottom 1.016: MF_IC1.14 17.98,37.5 9.87,37.5 7.69,35.31 J4.2
IC2_Y1
  Bottom 1.016: MF_IC2.3 15.95,54.77 9.67,54.77 5.15,50.25 J5.1
IC2_Y2
  Bottom 1.016: MF_IC2.6 21.54,52.74 10.69,52.74 7.69,49.74 J5.2
IC2_Y3
  Bottom 1.016: MF_IC2.11 23.57,70.01 9.67,70.01 5.15,65.49 J6.1
IC2_Y4
  Bottom 1.016: MF_IC2.14 17.98,67.98 9.67,67.98 7.69,66 J6.2
IC3_Y1
  Bottom 1.016: MF_IC3.3 15.95,85.25 9.47,85.25 5.15,80.93 J7.1
IC3_Y2
  Bottom 1.016: MF_IC3.6 20.52,82.2 9.67,82.2 7.69,80.22 J7.2
IC3_Y3
  Bottom 1.016: MF_IC3.11 23.57,100.49 9.67,100.49 5.15,95.97 J8.1
IC3_Y4
  Bottom 1.016: MF_IC3.14 17.98,98.46 9.87,98.46 7.69,96.27 J8.2
IC4_Y1
  Bottom 1.016: MF_IC4.3 15.95,115.73 10.89,115.73 9.67,115.73 5.15,111.21 J9.1
IC4_Y2
  Bottom 1.016: MF_IC4.6 20.32,112.48 9.47,112.48 7.69,110.7 J9.2
IC4_Y3
  Bottom 1.016: MF_IC4.11 25.4,129.14 8.45,129.14 5.2,125.89 J10.1
IC4_Y4
  Bottom 1.016: MF_IC4.14 17.88,125.28 8.25,125.28 7.69,125.84 J10.2
MCLR
  Bottom 0.406: MF_IC5.1 56.41,41.31 MF_R1.2
MIDI_MF_NG-RX  (via drill 0.33)
  Top 0.406: v39.95,61.17 42.08,59.04 53.46,59.04 55.14,57.36 55.14,41.71 51.58,38.16 51.58,28.61 52.08,28.11 M-IN.0
  Bottom 0.406: MF_IC5.26 39.95,78.09 v39.95,61.17
MIDI_MF_NG-TX  (via drill 0.33)
  Top 0.406: v40.86,57.51 41.88,56.5 53.41,56.5 54.12,55.79 54.12,42.58 50.72,39.17 50.72,28.61 50.22,28.11 M-OUT.0
  Bottom 0.406: MF_IC5.25 40.86,79.71 v40.86,57.51
N$1
  Bottom 0.406: MF_R22.1 48.84,126.04 MF_IC6.10
N$2
  Top 0.406: MF_R4.1 24.35,76.87 MF_LED1.A
N$3
  Top 0.203: M-OUT.I1 45.83,8.2 J1.4
N$4
  Top 0.203: M-OUT.I2 47.1,8.96 47.57,8.49 47.57,6.46 J1.3
N$5
  Top 0.203: M-OUT.I3 48.37,8.2 J1.6
N$6
  Top 0.203: M-OUT.I4 49.64,8.76 50.06,8.34 50.11,8.29 50.11,6.46 J1.5
N$7  (via drill 0.33)
  Top 0.203: v49.09,42.37 47.62,42.37 45.79,40.55 45.79,29.36 M-OUT.M1
  Bottom 0.203: J2.4 51.38,131.58 51.38,131.17 57.63,124.92 57.63,114.92 57.63,102.67 52.85,97.9 52.8,97.85 52.75,97.8 50.16,97.8 48.84,96.48 48.84,43.49 48.84,42.48 v49.09,42.37
N$8  (via drill 0.33)
  Top 0.203: v50.46,42.37 50.41,42.17 49.5,41.26 47.97,41.26 47.11,40.39 47.11,29.34 M-OUT.M2
  Bottom 0.203: J2.3 52.65,133.56 52.65,130.51 58.03,125.13 58.08,125.08 58.08,114.92 58.08,102.52 53,97.44 52.95,97.39 52.9,97.34 50.31,97.34 49.3,96.32 49.3,44.41 49.3,43.54 v50.46,42.37
N$9  (via drill 0.33)
  Top 0.203: v48.38,40.19 48.38,29.34 M-OUT.M3
  Bottom 0.203: J2.6 48.89,132.24 48.89,131.22 49.19,130.92 50.26,130.92 50.41,130.92 51.48,129.85 56.71,124.62 56.71,114.92 56.71,102.98 52.45,98.71 49.85,98.71 47.87,96.73 47.87,43.54 47.87,40.7 v48.38,40.19
N$10  (via drill 0.33)
  Top 0.203: v49.6,40.14 49.6,29.36 M-OUT.M4
  Bottom 0.203: J2.5 50.11,133.56 50.11,132.14 50.11,131.83 50.67,131.27 51.78,130.16 57.17,124.77 57.17,114.92 57.17,102.83 52.6,98.25 50.01,98.25 48.33,96.58 48.28,43.54 48.28,41.46 v49.6,40.14
N$11
  Top 0.203: M-IN.I1 52.63,10.25 51.38,9 J1.8
N$12
  Top 0.203: M-IN.I2 53.9,9.69 52.7,8.49 52.65,8.44 52.65,6.46 J1.7
N$13
  Top 0.203: M-IN.I3 55.17,8.98 J1.10
N$14
  Top 0.203: M-IN.I4 56.44,7.71 J1.9
N$15  (via drill 0.33)
  Top 0.203: v52.6,35.41 52.6,29.36 M-IN.M1
  Bottom 0.203: J2.8 46.25,132.24 46.25,130.87 47.11,130 49.8,130 50.11,130 50.87,129.24 55.8,124.31 55.8,114.92 55.8,103.39 55.8,103.33 55.8,103.28 52.14,99.63 49.55,99.63 46.96,97.04 46.96,40.49 46.96,39.78 50.77,35.97 52.04,35.97 v52.6,35.41
N$16  (via drill 0.33)
  Top 0.203: v53.92,35.41 53.92,29.34 M-IN.M2
  Bottom 0.203: J2.7 47.57,133.56 47.57,131.33 48.43,130.46 50.06,130.46 50.26,130.46 51.18,129.55 56.26,124.47 56.26,114.92 56.26,103.13 52.34,99.22 52.29,99.17 49.7,99.17 47.42,96.88 47.42,40.24 47.42,39.99 50.92,36.48 52.85,36.48 v53.92,35.41
N$17  (via drill 0.33)
  Top 0.203: v55.19,31.76 55.17,31.44 M-IN.M3
  Bottom 0.203: J2.10 43.81,132.24 43.81,130.66 45.28,129.14 49.3,129.14 49.75,129.14 54.88,124.01 54.88,114.92 54.88,103.59 51.94,100.64 51.84,100.54 49.19,100.54 46.04,97.39 46.04,39.48 51.43,34.09 53.77,34.09 55.19,32.67 v55.19,31.76
N$18  (via drill 0.33)
  Top 0.203: v56.46,31.76 56.46,29.34 M-IN.M4
  Bottom 0.203: J2.9 45.03,133.56 45.03,130.36 45.79,129.6 49.6,129.6 49.91,129.6 50.62,128.89 55.34,124.16 55.34,114.92 55.34,103.44 51.99,100.08 49.45,100.08 49.4,100.08 49.35,100.08 46.5,97.24 46.5,40.8 46.5,39.63 51.53,34.6 51.58,34.55 54.12,34.55 55.9,32.77 56.46,32.21 v56.46,31.76
N$98
  Top 1.016: MF_R20.1 20.34,6.46 MF_IC7.1
  Bottom 1.016: MF_R20.1 31.54,8.47 MF_P1.S 34.67,14.13 MF_P1.A
N$105
  Bottom 1.016: MF_P1.E 35.05,19.59 MF_R21.2
OSC1
  Bottom 0.406: MF_C1.1 56.71,70.77 MF_Q1.2 55.62,75.55 MF_IC5.13
OSC2
  Bottom 0.406: MF_IC5.14 55.52,78.09 MF_Q1.1 56.71,83.17 MF_C2.1
RA0
  Top 0.406: MF_IC5.2 49.65,47.61 40.96,38.92 40.96,34.86 38.53,32.42 36.7,32.42 35.58,31.3 35.58,26.22 34.67,25.31 15.97,25.31 8.6,17.94 6.37,17.94 5.15,16.72 J3.3
RA1  (via drill 0.33)
  Top 0.406: MF_IC5.3 51.18,50.15 40.35,39.33 40.15,39.12 40.15,36.89 38.22,34.96 34.56,34.96 32.84,33.23 v32.43,33.23
  Bottom 0.406: v32.43,33.23 32.38,33.18 6.42,33.18 J4.3
RA2  (via drill 0.33)
  Top 0.406: MF_IC5.4 52.65,52.64 40.56,40.55 39.34,39.33 39.34,38.51 38.32,37.5 34.67,37.5 v32.63,39.53
  Bottom 0.406: v32.63,39.53 23.54,48.42 6.42,48.42 J5.3
RA3  (via drill 0.33)
  Top 0.406: MF_IC5.5 51.12,53.7 51.12,52.53 51.12,52.33 51.12,52.13 40.76,41.76 39.14,40.14 39.03,40.04 36.39,40.04 35.38,40.04 v32.63,42.78 | v11.09,50.91 10.28,51.72 10.28,61.88 8.5,63.66 6.37,63.66 5.15,62.44 J6.3
  Bottom 0.406: v32.63,42.78 24.91,50.91 v11.09,50.91
RA4
  Bottom 0.406: MF_IC5.6 MF_R2.2
RA5  (via drill 0.33)
  Top 0.406: MF_IC5.7 39.95,73.01 39.95,93.99 39.34,94.6 36.7,94.6 34.67,92.56 v32.63,92.56
  Bottom 0.406: v32.63,92.56 31.21,91.14 31.21,85.45 22.12,76.36 6.42,76.36 J7.3
RB0
  Top 0.406: MF_IC2.15 20.57,62.85 MF_IC5.33
RB1  (via drill 0.33)
  Top 0.406: MF_IC2.10 29.92,65.11 30.45,64.57 35.08,64.57 v35.48,64.17
  Bottom 0.406: v35.48,64.17 35.48,60.87 36.14,60.31 MF_IC5.34
RB2
  Top 0.406: MF_IC2.7 31.5,57 36.49,57 37.26,57.77 MF_IC5.35
RB3
  Top 0.406: MF_IC2.2 20.57,55.23 MF_IC5.36
RB4
  Top 0.406: MF_IC1.15 34.19,52.69 MF_IC5.37
RB5
  Top 0.406: MF_IC1.10 29.99,35.79 29.99,45.63 34.51,50.15 MF_IC5.38
RB6
  Top 0.406: MF_IC1.7 31.21,29.39 31.21,44.2 34.61,47.61 MF_IC5.39
RB7  (via drill 0.33)
  Top 0.406: MF_IC1.2 18.8,26.52 33.65,26.52 v34.26,27.13
  Bottom 0.406: v34.26,27.13 35.48,28.35 35.48,43.39 37.15,45.07 MF_IC5.40
RC0
  Top 0.406: MF_IC5.15 43.2,90.08 43.2,97.44 40.15,100.49 38.93,101.71 29.18,101.71 18.51,112.38 18.51,125.89 17.24,127.16 MF_IC4.15
RC1
  Top 0.406: MF_IC5.16 44.01,91.8 44.01,97.85 40.96,100.9 39.34,102.52 30.19,102.52 28.67,104.05 28.67,125.89 29.92,127.14 MF_IC4.10
RC2
  Top 0.406: MF_IC5.17 44.83,93.53 44.83,98.25 41.78,101.3 39.75,103.33 31.01,103.33 29.92,104.42 MF_IC4.7
RC3  (via drill 0.33)
  Top 0.406: MF_IC5.18 45.64,95.05 45.64,98.46 42.59,101.71 40.15,104.15 31.82,104.15 31.21,104.76 v31.21,116.54
  Bottom 0.406: v31.21,116.54 31.21,120 30.4,120.81 18.49,120.81 MF_IC4.2
RC4
  Top 0.406: MF_IC3.15 17.22,92.13 18.61,90.74 34.46,90.74 35.07,90.13 36.95,88.25 MF_IC5.23
RC5
  Top 0.406: MF_IC5.24 38.37,85.71 39.14,86.47 39.14,86.67 39.14,87.08 39.14,88.7 38.32,89.52 36.88,89.52 36.88,89.54 34.87,91.55 30.8,91.55 29.99,92.36 29.92,92.43 MF_IC3.10
RD1  (1 unrouted)
  Top 0.406: 53.87,123.6 MF_IC6.9 50.01,119.79 50.01,112.33 44.83,107.14 44.83,101.15 52.6,93.38
RD2
  Bottom 0.406: MF_IC6.1 36.09,115.93 36.09,109.63 40.15,105.57 40.15,103.33 40.15,94.8 38.73,93.38 37.46,93.38 MF_IC5.21
RD3
  Bottom 0.406: MF_IC6.2 37.31,114.71 37.31,109.63 40.96,105.98 40.96,105.16 40.96,104.76 40.96,92.77 38.98,90.79 MF_IC5.22
RD4  (via drill 0.33)
  Top 0.406: v45.31,48.72 37.87,41.31 MF_R12-15.1
  Bottom 0.406: MF_IC5.27 38.93,76.77 38.93,76.72 38.93,42.37 37.87,41.31 MF_R12-15.1 | v45.31,48.72 45.23,48.88 45.23,98.46 45.23,107.09 MF_R16-19.1
RD5
  Top 0.406: MF_IC5.28 MF_R4.2
RD6
  Top 0.406: MF_IC3.7 29.92,74.96 31.82,73.06 37.36,73.06 MF_IC5.29
RD7
  Top 0.406: MF_IC3.2 17.22,79.12 25.72,70.62 37.26,70.62 MF_IC5.30
RE0  (via drill 0.33)
  Top 0.406: MF_IC5.8 40.76,74.73 40.76,94.39 38.73,96.43 35.68,96.43 33.55,94.39 31.82,94.39 v31.21,93.78
  Bottom 0.406: v31.21,93.78 29.03,91.6 6.42,91.6 J8.3
RE1  (via drill 0.33)
  Top 0.406: MF_IC5.9 41.57,76.46 41.57,94.8 37.31,99.07 27.15,99.07 v22.27,103.94
  Bottom 0.406: v22.27,103.94 19.43,106.79 6.47,106.79 J9.3
RE2  (via drill 0.33)
  Top 0.406: MF_IC5.10 42.39,78.19 42.39,97.04 39.34,100.08 38.53,100.9 28.16,100.9 v22.27,106.79 | v11.09,109.23 6.42,113.9 6.42,122.03 5.15,123.3 J10.3
  Bottom 0.406: v22.27,106.79 19.83,109.23 v11.09,109.23
TS1
  Top 0.406: J3.4 8.76,16.67 16.38,24.29 25.72,24.29 36.9,24.29 37.51,24.9 38.93,26.32 38.93,29.78 37.56,31.15 MF_R12-15.5
  Bottom 0.406: MF_R12-15.5 44.42,38.06 44.42,96.22 44.42,109.58 47.47,112.63 47.47,122.18 48.74,123.45 MF_IC6.11
TS2  (via drill 0.33)
  Top 0.406: MF_R12-15.4 35.53,33.69 33.04,31.2 v32.43,31.2
  Bottom 0.406: v32.43,31.2 12.11,31.2 11.6,31.91 J4.4 | MF_R12-15.4 43.61,39.78 43.61,96.22 43.61,111.26 44.93,112.58 44.93,122.23 46.2,123.5 MF_IC6.12
TS3  (via drill 0.33)
  Top 0.406: MF_R12-15.3 34.31,36.23 v32.63,37.9
  Bottom 0.406: v32.63,37.9 23.39,47.15 J5.4 | MF_IC6.13 42.44,122.38 42.44,111.61 42.79,111.26 42.79,42.17 42.79,41.51 MF_R12-15.3
TS4  (via drill 0.33)
  Top 0.406: MF_R12-15.2 35.02,38.77 v32.63,41.16 | v10.08,49.69 9.06,50.71 9.06,61.07 7.74,62.39 J6.4
  Bottom 0.406: v32.63,41.16 24.3,49.69 v10.08,49.69 | MF_IC6.14 41.12,123.65 39.85,122.38 39.85,109.13 41.98,106.99 41.98,86.67 41.98,43.59 41.98,43.24 MF_R12-15.2
TS5  (via drill 0.33)
  Top 0.406: MF_R16-19.5 41.12,110.5 37.76,107.14 v37.51,106.89 | v37.51,95.51 36.19,95.51 34.26,93.58 32.43,93.58 v31.31,92.46
  Bottom 0.406: v37.51,106.89 v37.51,95.51 | v31.31,92.46 28.67,89.82 28.67,84.69 21.61,77.63 J7.4 | MF_IC6.3 MF_R16-19.5
TS6  (via drill 0.33)
  Top 0.406: MF_R16-19.4 43.66,110.34 39.29,105.98 v35.43,105.98 | v35.43,97.59 33.04,95.21 v31.01,95.21
  Bottom 0.406: v35.43,105.98 35.43,104.76 v35.43,97.59 | v31.01,95.21 28.67,92.87 J8.4 | MF_IC6.4 MF_R16-19.4
TS7  (via drill 0.33)
  Top 0.406: MF_R16-19.3 46.25,111.67 40.96,106.38 39.64,105.06 v39.14,105.06 | v38.42,99.73 38.27,99.88 37.71,99.88 27.76,99.88 v22.27,105.37
  Bottom 0.406: v39.14,105.06 39.14,102.52 38.42,101.81 v38.42,99.73 | MF_IC6.5 MF_R16-19.3 | v22.27,105.37 19.53,108.11 J9.4
TS8  (via drill 0.33)
  Top 0.406: MF_IC6.6 43.86,120.86 v35.68,120.86
  Bottom 0.406: J10.4 8.66,122.38 12.92,122.38 32.63,122.38 34.16,122.38 v35.68,120.86 | MF_IC6.6 MF_R16-19.2

### Text on the board
tNames: 5V | 5V | MI1 | MO3 | MO1 | 5V | I3 | I2 | I1 | I0 | QH | GND | SER | Vm | LD | CLK | I4 | I5 | I6 | I7 | QH# | GND | (C)Midibox.org, VLRlab.com / MF_NG V2.0.1 | 5V | Vm | MO | MI | 5V | Vm | 5V | sets the Input / ether from a prev. / Modul or from / the Core | sets the backlink / ether to a next / Modul or to / the Core | Vm | solder only / one point / per section | Internal Link / to next Modul | 5V | MO1 | MO3 | MI1 | MI3
bNames: 5V | GND | 12V | MI4 | MI2 | MO4 | MO2 | GND | 5V | MI3 | MI1 | MO3 | MO1 | 5V | M81 | M82 | W | T7 | Vm | 5V | GND | 5V | I3 | I2 | I1 | I0 | GND | SER | QH | Fader 8 | LD | CLK | I4 | I5 | I6 | I7 | QH# | GND | M72 | T4 | T5 | T6 | T7 | M71 | T6 | W | GND | 5V | Fader 7 | 5V | M62 | M61 | T5 | W | GND | 5V | Fader 6 | Vm | MO | M51 | M52 | MI | W | T4 | 5V | GND | Fader 5 | 5V | M41 | M42 | W | T3 | 5V | GND | Fader 4 | Vm | M32 | M31 | T2 | W | GND | 5V | Fader 3 | 5V | T3 | M22 | T2 | M21 | T1 | T1 | W | T0 | 5V | GND | Fader 2 | Vm | M11 | M12 | W | T0 | 5V | GND | Fader 1 | 5V | MO1 | MO3 | MI1 | MI3 | 12V | GND | 5V | GND | MO2 | MO4 | MI2 | MI4